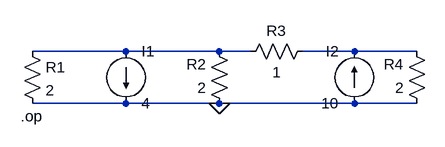
[diagram p0: schematic s1041555-hw1.asc]
s1041555-hw1.asc, the LTspice schematic file:
Version 4
SHEET 1 880 680
WIRE -16 64 -160 64
WIRE 128 64 -16 64
WIRE 176 64 128 64
WIRE 336 64 256 64
WIRE 432 64 336 64
WIRE -16 144 -160 144
WIRE 128 144 -16 144
WIRE 336 144 128 144
WIRE 432 144 336 144
FLAG 128 144 0
SYMBOL res -176 48 R0
SYMATTR InstName R1
SYMATTR Value 2
SYMBOL res 144 160 R180
WINDOW 0 36 76 Left 2
WINDOW 3 36 40 Left 2
SYMATTR InstName R2
SYMATTR Value 2
SYMBOL res 448 160 R180
WINDOW 0 36 76 Left 2
WINDOW 3 36 40 Left 2
SYMATTR InstName R4
SYMATTR Value 2
SYMBOL res 160 80 R270
WINDOW 0 32 56 VTop 2
WINDOW 3 0 56 VBottom 2
SYMATTR InstName R3
SYMATTR Value 1
SYMBOL current -16 64 R0
WINDOW 123 0 0 Left 2
WINDOW 39 0 0 Left 2
SYMATTR InstName I1
SYMATTR Value 4
SYMBOL current 336 144 R180
WINDOW 0 24 80 Left 2
WINDOW 3 24 0 Left 2
WINDOW 123 0 0 Left 2
WINDOW 39 0 0 Left 2
SYMATTR InstName I2
SYMATTR Value 10
TEXT -178 164 Left 2 !.op

The netlist it stands for:
* s1041555-hw1.asc
R1 N001 0 2
R2 0 N001 2
R4 0 N002 2
R3 N001 N002 1
I1 N001 0 4
I2 0 N002 10
.op
.backanno
.end